# Altium schematic sheet ATT7022EU.SchDoc
size A4
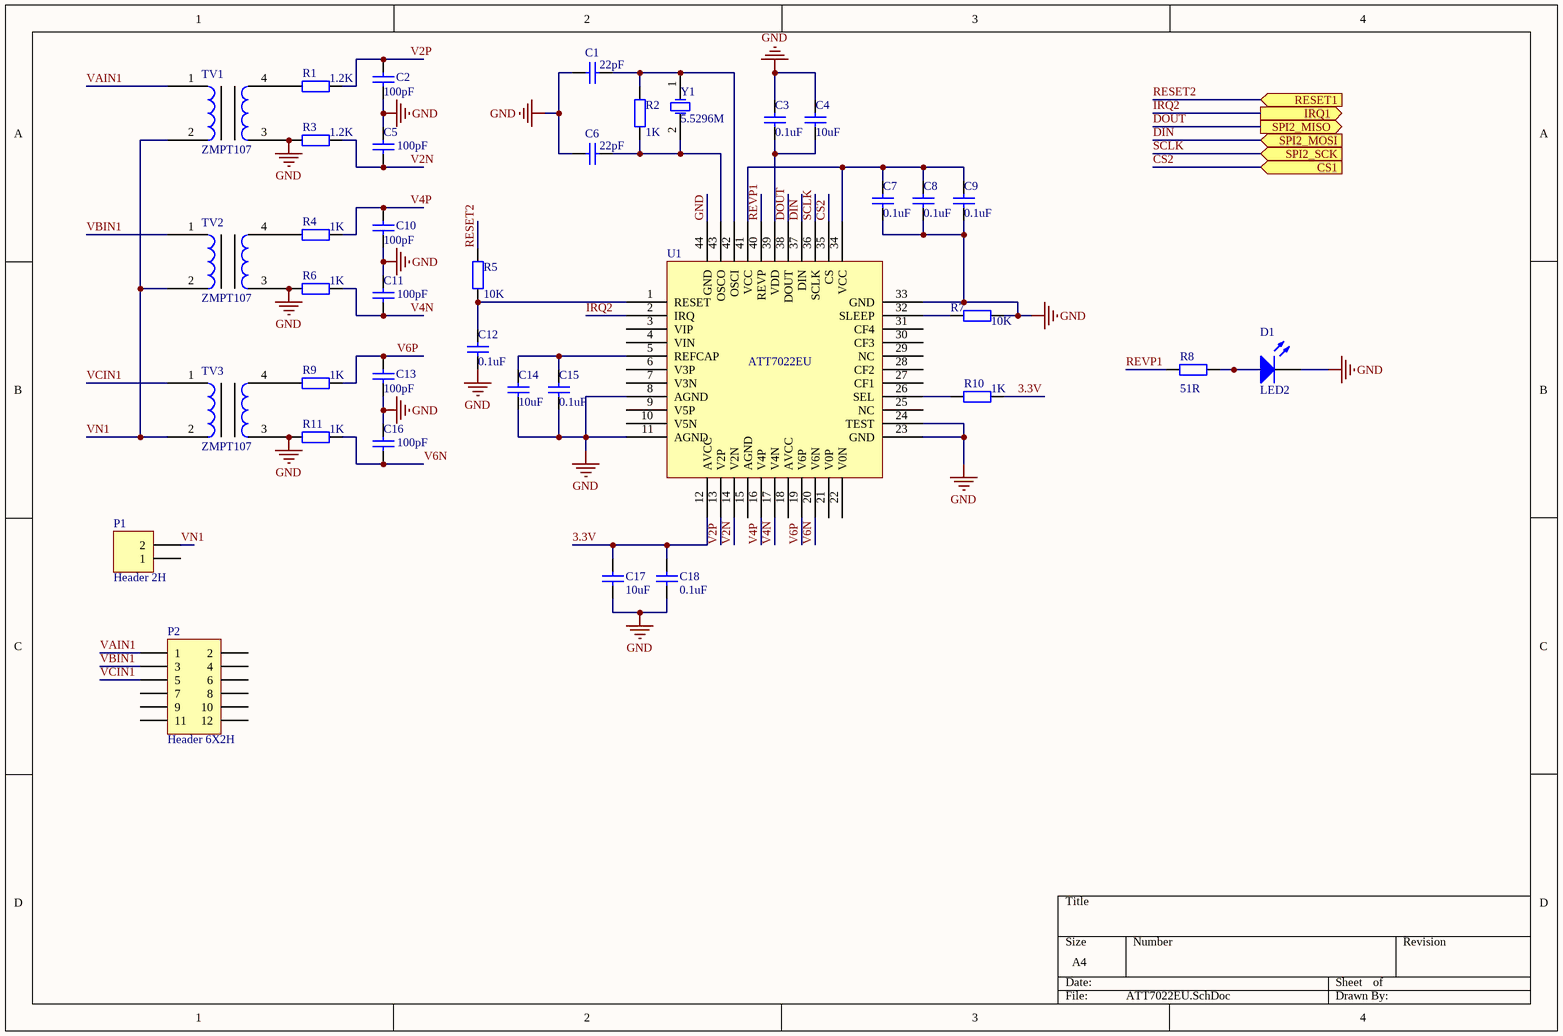
[diagram p0: ATT7022EU.SchDoc]

## Parts
C1  value 22pF  [C1206]  (hidden comment: Cap Semi)
C2  value 100pF  [RAD-0.3]  (hidden comment: Cap)
C3  value 0.1uF  [RAD-0.3]  (hidden comment: Cap)
C4  value 10uF  [RAD-0.3]  (hidden comment: Cap)
C5  value 100pF  [RAD-0.3]  (hidden comment: Cap)
C6  value 22pF  [C1206]  (hidden comment: Cap Semi)
C7  value 0.1uF  [RAD-0.3]  (hidden comment: Cap)
C8  value 0.1uF  [RAD-0.3]  (hidden comment: Cap)
C9  value 0.1uF  [RAD-0.3]  (hidden comment: Cap)
C10  value 100pF  [RAD-0.3]  (hidden comment: Cap)
C11  value 100pF  [RAD-0.3]  (hidden comment: Cap)
C12  value 0.1uF  [RAD-0.3]  (hidden comment: Cap)
C13  value 100pF  [RAD-0.3]  (hidden comment: Cap)
C14  value 10uF  [RAD-0.3]  (hidden comment: Cap)
C15  value 0.1uF  [RAD-0.3]  (hidden comment: Cap)
C16  value 100pF  [RAD-0.3]  (hidden comment: Cap)
C17  value 10uF  [RAD-0.3]  (hidden comment: Cap)
C18  value 0.1uF  [RAD-0.3]  (hidden comment: Cap)
D1  LED2  [3.2X1.6X1.1]
P1  Header 2H  [HDR1X2H]
P2  Header 6X2H  [HDR2X6H]
R1  value 1.2K  [AXIAL-0.4]  (hidden comment: Res2)
R2  value 1K  [AXIAL-0.4]  (hidden comment: Res2)
R3  value 1.2K  [AXIAL-0.4]  (hidden comment: Res2)
R4  value 1K  [AXIAL-0.4]  (hidden comment: Res2)
R5  value 10K  [AXIAL-0.4]  (hidden comment: Res2)
R6  value 1K  [AXIAL-0.4]  (hidden comment: Res2)
R7  value 10K  [AXIAL-0.4]  (hidden comment: Res2)
R8  value 51R  [AXIAL-0.4]  (hidden comment: Res2)
R9  value 1K  [AXIAL-0.4]  (hidden comment: Res2)
R10  value 1K  [AXIAL-0.4]  (hidden comment: Res2)
R11  value 1K  [AXIAL-0.4]  (hidden comment: Res2)
TV1  ZMPT107  [ZTMP107]
TV2  ZMPT107  [ZTMP107]
TV3  ZMPT107  [ZTMP107]
U1  ATT7022EU
Y1  5.5296M  [R38]

## Ports
CS1 (in), IRQ1 (out), RESET1 (in), SPI2_MISO (out), SPI2_MOSI (in), SPI2_SCK (in)

## Nets
GND: C1.1 C2.1 C3.2 C4.1 C5.2 C6.1 C7.1 C8.1 C9.1 C10.1 C11.2 C12.1 C13.1 C14.1 C15.1 C16.2 C17.1 C18.1 D1.2(K) R3.1 R6.1 R7.2 R11.1 TV1.3 TV2.3 TV3.3 U1.8(AGND) U1.11(AGND) U1.23(GND) U1.24(TEST) U1.33(GND) U1.44(GND)
3.3V: C17.2 C18.2 R10.2 U1.12(AVCC)
CS2: U1.35(CS) ; port CS1
DIN: U1.37(DIN) ; port SPI2_MOSI
DOUT: U1.38(DOUT) ; port SPI2_MISO
IRQ2: U1.2(IRQ) ; port IRQ1
RESET2: R5.2 ; port RESET1
REVP1: R8.1 U1.40(REVP)
SCLK: U1.36(SCLK) ; port SPI2_SCK
V2N: C5.1 R3.2 U1.14(V2N)
V2P: C2.2 R1.2 U1.13(V2P)
V4N: C11.1 R6.2 U1.17(V4N)
V4P: C10.2 R4.2 U1.16(V4P)
V6N: C16.1 R11.2 U1.20(V6N)
V6P: C13.2 R9.2 U1.19(V6P)
VAIN1: P2.1 TV1.1
VBIN1: P2.3 TV2.1
VCIN1: P2.5 TV3.1
VN1: P1.2 TV1.2 TV2.2 TV3.2
NetC1_2: C1.2 R2.2 U1.42(OSCI) Y1.1(OSC1)
NetC3_1: C3.1 C4.2 U1.39(VDD)
NetC6_2: C6.2 R2.1 U1.43(OSCO) Y1.2(OSC2)
NetC7_2: C7.2 C8.2 C9.2 U1.34(VCC) U1.41(VCC)
NetC12_2: C12.2 R5.1 U1.1(RESET)
NetC14_2: C14.2 C15.2 U1.5(REFCAP)
NetD1_1: D1.1(A) R8.2
NetR1_1: R1.1 TV1.4
NetR4_1: R4.1 TV2.4
NetR7_1: R7.1 U1.32(SLEEP)
NetR9_1: R9.1 TV3.4
NetR10_1: R10.1 U1.26(SEL)

Not connected (* = marked no-connect by the designer): P1 1; P2 2 4 6 7 8 9 10 11 12; U1 3(VIP) 4(VIN) 6(V3P) 7(V3N) 9(V5P) 10(V5N) 15(AGND) 18(AVCC) 21(V0P) 22(V0N) 25(NC) 27(CF1) 28(CF2) 29(NC) 30(CF3) 31(CF4)

## Library data of the parts
C1 C6 = Cap Semi: Capacitor (Semiconductor SIM Model); Published: 8-Jun-2000; LatestRevisionDate: 29-May-2009; LatestRevisionNote: IPC-7351 Footprint Added.; PackageReference: C1206; Publisher: Altium Limited; PackageDescription: Chip Capacitor
C2-C5 C7-C18 = Cap: Capacitor; Published: 8-Jun-2000; LatestRevisionDate: 17-Jul-2002; LatestRevisionNote: Re-released for DXP Platform.; PackageReference: RAD-0.3; Publisher: Altium Limited; PackageDescription: Radial Cap, Thru-Hole; 2 Leads; 0.3 in Pin Spacing
D1 = LED2: Typical RED, GREEN, YELLOW, AMBER GaAs LED; Published: 8-Jun-2000; LatestRevisionDate: 17-Jul-2002; LatestRevisionNote: Re-released for DXP Platform.; PackageVersion: Feb-2002; PackageReference: 3.2X1.6X1.1; Publisher: Altium Limited; PackageDescription: SM LED; 2 Flat Leads
P1 = Header 2H: Header, 2-Pin, Right Angle; LatestRevisionDate: 17-Jul-2002; LatestRevisionNote: Re-released for DXP Platform.; Publisher: Altium Limited
P2 = Header 6X2H: Header, 6-Pin, Dual row, Right Angle; LatestRevisionDate: 17-Jul-2002; LatestRevisionNote: Re-released for DXP Platform.; Publisher: Altium Limited
R1-R11 = Res2: Resistor; Published: 8-Jun-2000; LatestRevisionDate: 17-Jul-2002; LatestRevisionNote: Re-released for DXP Platform.; PackageReference: AXIAL-0.4; Publisher: Altium Limited; PackageDescription: Axial Device, Thru-Hole; 2 Leads; 0.4 in Pin Spacing
Y1 = XTAL: Crystal Oscillator; Published: 8-Jun-2000; LatestRevisionDate: 17-Jul-2002; LatestRevisionNote: Re-released for DXP Platform.; PackageReference: R38; Publisher: Altium Limited; PackageDescription: Crystal, Thru-Hole; 2 Leads; Body 3.1 x 8.2 mm (Dia.xH)